# EAGLE design Nunchuck Board (EAGLE 7.1.0)
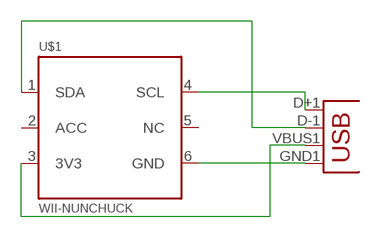
[diagram p0: schematic, sheet 1]

## Parts
JP1  USBA-SMD-MALE  [USB-A-SMT-MALE]
U$1  WII-NUNCHUCK  [WII_6PIN]

## Nets
N$1: JP1.GND1(GND) U$1.6(GND)
N$2: JP1.VBUS1(VBUS) U$1.3(3V3)
N$3: JP1.D-1(D-) U$1.1(SDA)
N$4: JP1.D+1(D+) U$1.4(SCL)
Unconnected: U$1.2(ACC) U$1.5(NC)

## Library data of the parts
JP1 = SparkFun-Connectors:USB: USB Connectors USB-B-PTH is fully proven SKU : PRT-00139/CONN-08278 USB-miniB is fully proven SKU : PRT-00587 USB-A-PCB is untested. USB-A-H is throughly reviewed, but untested. Spark Fun Electronics SKU : PRT-00437 USB-B-SMT is throughly reviewed, but untested. Needs silkscreen touching up. USB-A-S has not been used/tested USB-MB-H has not been used/tested USB-MICROB has been used. CONN-09505
U$1 = SparkFun-Connectors:WII-NUNCHUCK

## Board
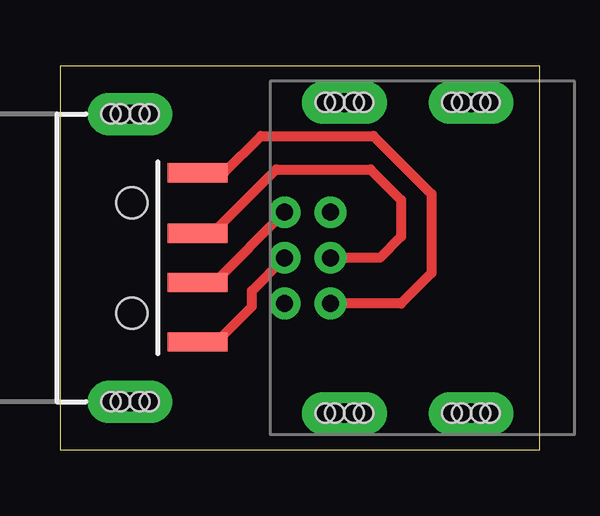
[diagram p1: board, top side]

Size 20 x 16 mm. Coordinates in mm from the lower left corner, seen from the top.
Outline: 0,0 20,0 20,16 0,16 0,0
Copper layers (1*16): Top 0.035mm / dielectric 1.5mm / Bottom 0.035mm
Design rules "SparkFun": minimum track width 8mil, minimum drill 20mil, track to track 8mil, track to pad 8mil, pad to pad 8mil, via to via 8mil, smd to smd 8mil, copper to edge 10mil, drill to drill 8mil, minimum pad ring 12mil, minimum via ring 10mil, stop-mask expansion 4mil, vias tented up to drill 25mil, thermal gap 10mil

### Footprints (pad centres in the part's own frame; a part is rotated, then mirrored left to right if it is on the bottom)
USB-A-SMT-MALE = smd 0.8 x 2.5: D+1 1.027,-5.87; D-1 -1.027,-5.87; GND1 3.551,-5.87; VBUS1 -3.5,-5.87 | drill 0.8 pad 1.778 long: P$1 6,-3.05; P$3 -6,-3.05 | hole 1.3: 2.3,-3.12; -2.3,-3.12 | hole 0.8: -6,-3.45; -6,-3.85; -6,-2.65; -6,-2.25; 6,-3.45; 6,-3.85; 6,-2.65; 6,-2.25
WII_6PIN = drill 0.711: 1 -1.905,-5.74; 2 -1.905,-3.835; 3 0,-5.74; 4 0,-3.835; 5 1.905,-5.74; 6 1.905,-3.835 | drill 0.8 pad 1.778 long: P$7 -6.477,-3.251; P$8 -6.477,2.032; P$9 6.477,2.032; P$10 6.477,-3.251 | hole 0.8: -6.477,1.632; -6.477,1.232; -6.477,2.432; -6.477,2.832; 6.477,1.632; 6.477,1.232; 6.477,2.432; 6.477,2.832; 6.477,-3.651; 6.477,-4.051; 6.477,-2.851; 6.477,-2.451; -6.477,-3.651; -6.477,-4.051; -6.477,-2.851; -6.477,-2.451

### Placement (x,y rotation side)
JP1  -0.13,8 90 top
U$1  15.11,8 270 top

### Tracks (layer width: path | path; a pad name or v marks a point on that pad's centre or on a via)
N$1
  Top 0.406: JP1.GND1 6.85,11.55 8.38,13.08 13.08,13.08 15.49,10.67 15.49,7.37 14.22,6.1 U$1.6
N$2
  Top 0.406: JP1.VBUS1 6.53,4.5 8,5.97 8,6.63 U$1.3
N$3
  Top 0.406: JP1.D-1 6.44,6.97 U$1.1
N$4
  Top 0.406: JP1.D+1 6.36,9.03 9.02,11.68 12.95,11.68 14.22,10.41 14.22,8.89 13.34,8 U$1.4